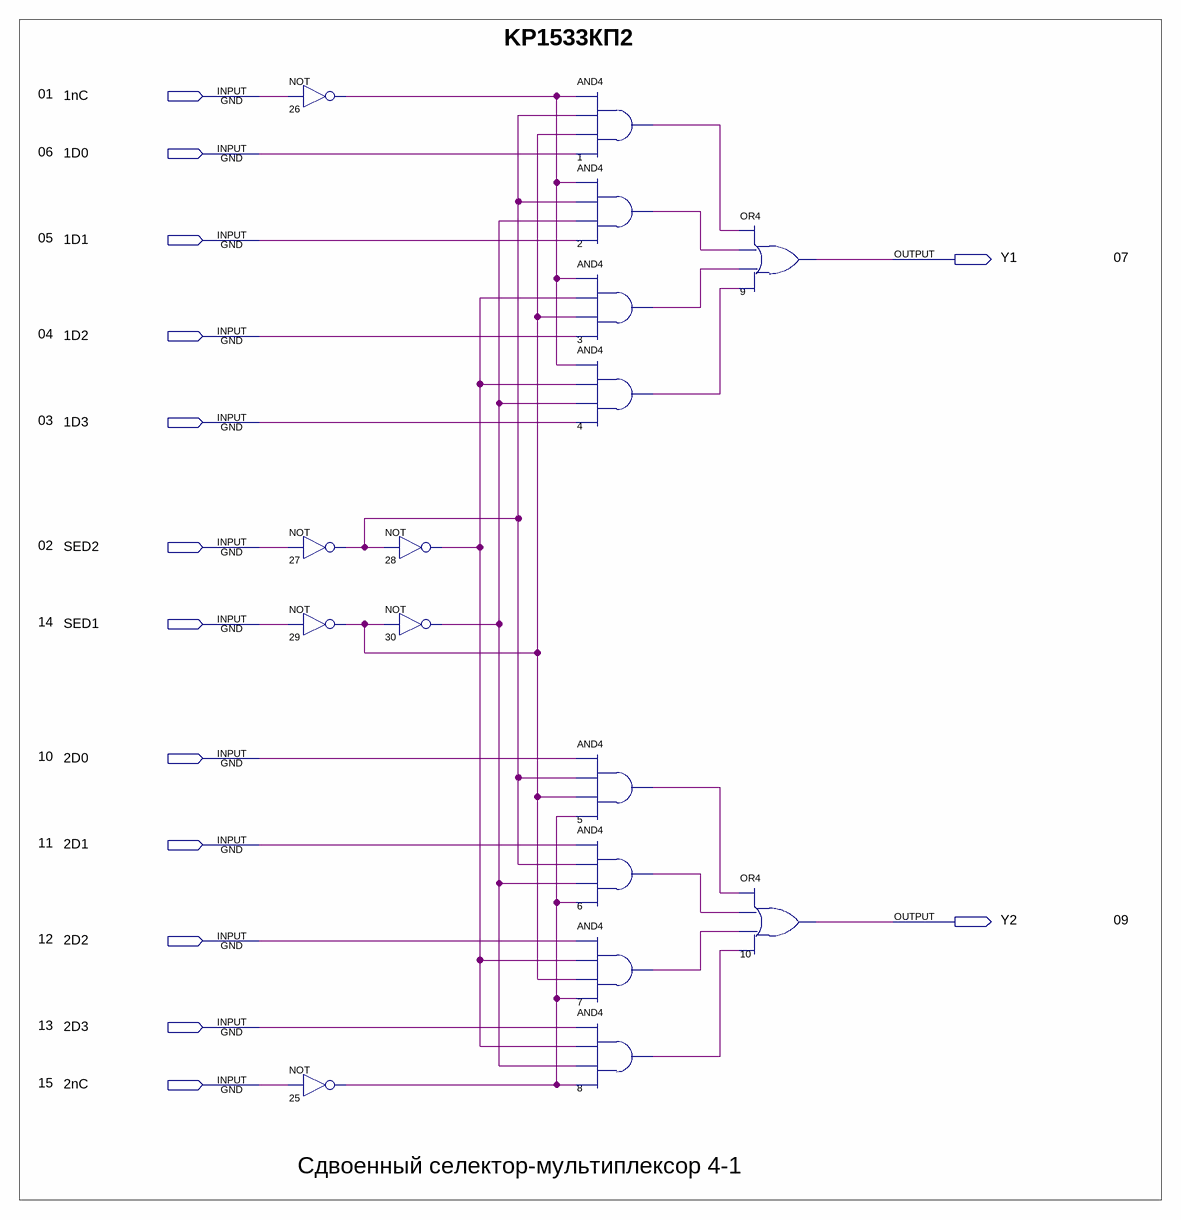
[diagram p0: schematic sheet]
// Quartus schematic KP1533KP2.bdf as structural Verilog: 16 symbols, 14 pins
module KP1533KP2 (
  input  \1nC ,
  input  \1D0 ,
  input  \1D1 ,
  input  \1D2 ,
  input  \1D3 ,
  input  SED2,
  input  SED1,
  input  \2D0 ,
  input  \2D1 ,
  input  \2D2 ,
  input  \2D3 ,
  input  \2nC ,
  output Y1,
  output Y2
);

  wire n1_out, n2_out, n3_out, n4_out, n5_out, n6_out, n7_out, n8_out, n25_out, n26_out, n27_out, n28_out,
       n29_out, n30_out;

  not u_26 (n26_out, \1nC );
  not u_27 (n27_out, SED2);
  not u_29 (n29_out, SED1);
  not u_25 (n25_out, \2nC );
  not u_28 (n28_out, n27_out);
  not u_30 (n30_out, n29_out);
  and u_1 (n1_out, n26_out, n27_out, n29_out, \1D0 );
  and u_2 (n2_out, n26_out, n27_out, n30_out, \1D1 );
  and u_3 (n3_out, n26_out, n28_out, n29_out, \1D2 );
  and u_4 (n4_out, n26_out, n28_out, n30_out, \1D3 );
  and u_5 (n5_out, \2D0 , n27_out, n29_out, n25_out);
  and u_6 (n6_out, \2D1 , n27_out, n30_out, n25_out);
  and u_7 (n7_out, \2D2 , n28_out, n29_out, n25_out);
  and u_8 (n8_out, \2D3 , n28_out, n30_out, n25_out);
  or u_9 (Y1, n1_out, n2_out, n3_out, n4_out);
  or u_10 (Y2, n5_out, n6_out, n7_out, n8_out);

  // Notes on the sheet:
  //   KP1533КП2
  //   01
  //   06
  //   05
  //   07
  //   04
  //   03
  //   02
  //   14
  //   10
  //   11
  //   09
  //   12
  //   13
  //   15
  //   Сдвоенный селектор-мультиплексор 4-1
endmodule
